# EAGLE design rainGauge (EAGLE 9.5.1)
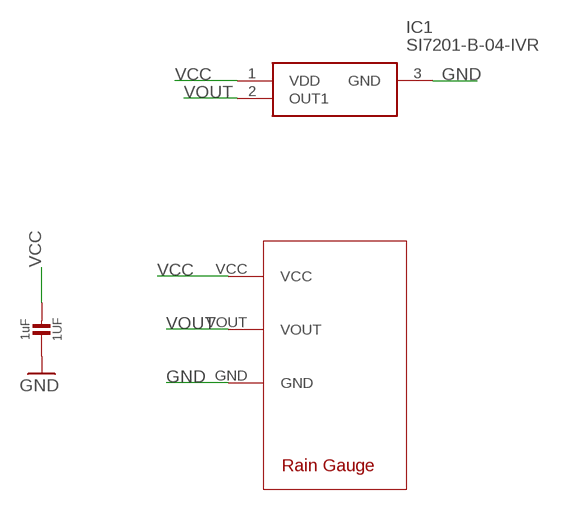
[diagram p0: schematic, sheet 1]

## Parts
1UF  1uF  CAP_CERAMIC0805-NOOUTLINE  [0805-NO]
IC1  SI7201-B-04-IVR  [SOT95P275X125-3N]
U$1  RAINGAUGERAINPAD  [RAINGAUGE]

## Nets
GND: 1UF.1 IC1.3(GND) U$1.GND
VCC: 1UF.2 IC1.1(VDD) U$1.VCC
VOUT: IC1.2(OUT1) U$1.VOUT

## Library data of the parts
1UF = microbuilder:CAP_CERAMIC: Ceramic Capacitors For new designs, use the packages preceded by an '_' character since they are more reliable: The following footprints should be used on most boards: _0402 - Standard footprint for regular board layouts _0603 - Standard footprint for regular board layouts _0805 - Standard footprint for regular board layouts _1206 - Standard footprint for regular board layouts For extremely tight-pitch boards where space is at a premium, the following 'micro-pitch' footprints can be used (smaller pads, no silkscreen outline, etc.): _0402MP - Micro-pitch footprint for very dense/compact boards _0603MP - Micro-pitch footprint for very dense/compact boards _0805MP - Micro-pitch footprint for very dense/compact boards _1206MP - Micro-pitch footprint for very dense/compact boards
IC1 = Si7201-B-04-IVR:SI7201-B-04-IVR: Silicon Laboratories Si7201-B-04-IVR, Omnipolar Hall Effect Sensor Switch, 3-Pin SOT-23 Source: Datasheet <http://uk.rs-online.com/web/p/products/1446543>; DESCRIPTION: Silicon Laboratories Si7201-B-04-IVR, Omnipolar Hall Effect Sensor Switch, 3-Pin SOT-23; HEIGHT: 1.25mm; MANUFACTURER_NAME: Silicon Labs; MANUFACTURER_PART_NUMBER: Si7201-B-04-IVR; RS_PART_NUMBER: 1446543; RS_PRICE-STOCK: http://uk.rs-online.com/web/p/products/1446543
U$1 = rainGauge:RAINGAUGE

## Board
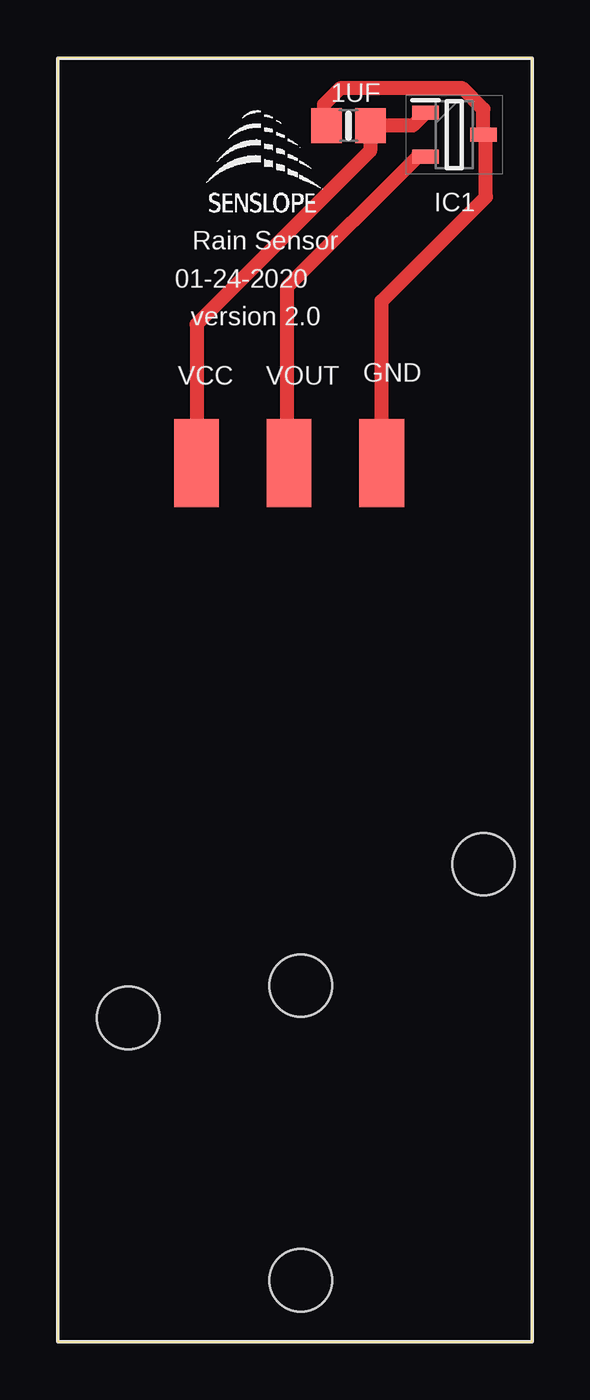
[diagram p1: board, top side]

Size 20.5 x 55.52 mm. Coordinates in mm from the lower left corner, seen from the top.
Outline: 0,0 20.5,0 20.5,55.52 0,55.52 0,0
Copper layers (1*16): Top 0.035mm / dielectric 1.5mm / Bottom 0.035mm
Design rules "default": minimum track width 6mil, minimum drill 0.35mm, track to track 6mil, track to pad 6mil, pad to pad 6mil, via to via 6mil, smd to smd 6mil, copper to edge 40mil, drill to drill 6mil, minimum pad ring 10mil, minimum via ring 8mil, stop-mask expansion 4mil, vias tented up to drill 0mil, thermal gap 10mil

### Footprints (pad centres in the part's own frame; a part is rotated, then mirrored left to right if it is on the bottom)
0805-NO = smd 1.3 x 1.5: 1 -0.95,0; 2 0.95,0
SOT95P275X125-3N = smd 1.15 x 0.6: 1 -1.25,0.95; 2 -1.25,-0.95; 3 1.25,0
RAINGAUGE = smd 1.93 x 3.81: GND 14,38; VCC 6,38; VOUT 10,38 | hole 2.7: 10.5,2.65; 10.5,15.4; 3.05,14; 18.4,20.65

### Placement (x,y rotation side)
1UF  12.56,52.59 0 top
IC1  17.14,52.2 0 top
U$1  0,0 0 top
U$2  [LOGO_SML_TNAME]  8.72,50.45 0 top

### Tracks (layer width: path | path; a pad name or v marks a point on that pad's centre or on a via)
GND
  Top 0.61: U$1.GND 14,45 18.5,49.5 18.5,52.09 IC1.3 18.39,53.3 17.5,54.2 12.2,54.2 11.5,53.5 11.5,52.7 1UF.1
VCC
  Top 0.61: IC1.1 15.33,52.59 1UF.2 13.5,52.57 13.5,51.5 6,44 U$1.VCC
VOUT
  Top 0.61: IC1.2 15.55,51.25 9.91,45.6 9.91,37.08 10,37.18 U$1.VOUT

### Text on the board
tNames: Rain Sensor | 01-24-2020 | version 2.0 | GND | VCC | VOUT